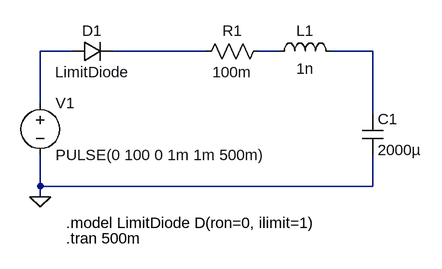
[diagram p0: schematic main.asc]
main.asc, the LTspice schematic file:
Version 4
SHEET 1 880 680
WIRE 32 32 -16 32
WIRE 240 32 96 32
WIRE 352 32 320 32
WIRE 496 32 432 32
WIRE -16 112 -16 32
WIRE 496 128 496 32
WIRE -16 240 -16 192
WIRE 496 240 496 192
WIRE 496 240 -16 240
WIRE -16 256 -16 240
FLAG -16 256 0
SYMBOL voltage -16 96 R0
WINDOW 123 0 0 Left 0
WINDOW 39 0 0 Left 0
SYMATTR InstName V1
SYMATTR Value PULSE(0 100 0 1m 1m 500m)
SYMBOL diode 32 48 R270
WINDOW 0 32 32 VTop 2
WINDOW 3 0 32 VBottom 2
SYMATTR InstName D1
SYMATTR Value LimitDiode
SYMBOL res 336 16 R90
WINDOW 0 0 56 VBottom 2
WINDOW 3 32 56 VTop 2
SYMATTR InstName R1
SYMATTR Value 100m
SYMBOL ind 336 48 R270
WINDOW 0 32 56 VTop 2
WINDOW 3 5 56 VBottom 2
SYMATTR InstName L1
SYMATTR Value 1n
SYMBOL cap 480 128 R0
SYMATTR InstName C1
SYMATTR Value 2000µ
TEXT 24 296 Left 2 !.model LimitDiode D(ron=0, ilimit=1)
TEXT 24 320 Left 2 !.tran 500m

The netlist it stands for:
* main.asc
V1 N001 0 PULSE(0 100 0 1m 1m 500m)
D1 N001 N002 LimitDiode
R1 N003 N002 100m
L1 N003 N004 1n
C1 N004 0 2000µ
.model D D
.lib standard.dio
.model LimitDiode D(ron=0, ilimit=1)
.tran 500m
.backanno
.end